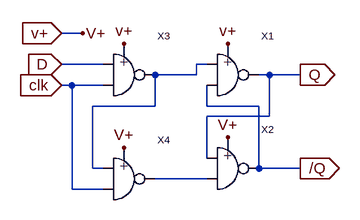
[diagram p0: schematic D-LATCH.asc]
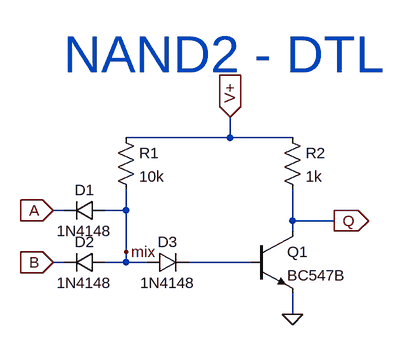
[diagram p1: sub-circuit nand2.asc]
D-LATCH.asc, the LTspice schematic file:
Version 4
SHEET 1 880 680
WIRE 128 176 96 176
WIRE 160 224 96 224
WIRE 320 224 304 224
WIRE 304 240 304 224
WIRE 304 240 240 240
WIRE 416 240 400 240
WIRE 464 240 416 240
WIRE 112 256 96 256
WIRE 160 256 112 256
WIRE 240 288 240 240
WIRE 240 288 144 288
WIRE 320 288 320 256
WIRE 400 288 320 288
WIRE 416 304 416 240
WIRE 416 304 320 304
WIRE 320 368 320 304
WIRE 144 384 144 288
WIRE 160 384 144 384
WIRE 400 384 400 288
WIRE 464 384 400 384
WIRE 320 400 240 400
WIRE 112 416 112 256
WIRE 160 416 112 416
FLAG 352 192 v+
FLAG 96 176 v+
IOPIN 96 176 In
FLAG 192 192 v+
FLAG 464 384 /Q
IOPIN 464 384 Out
FLAG 464 240 Q
IOPIN 464 240 Out
FLAG 96 224 D
IOPIN 96 224 In
FLAG 96 256 clk
IOPIN 96 256 In
FLAG 128 176 V+
FLAG 192 352 V+
FLAG 352 336 V+
SYMBOL NAND2 352 240 R0
SYMATTR InstName X1
SYMBOL NAND2 352 384 R0
SYMATTR InstName X2
SYMBOL NAND2 192 240 R0
SYMATTR InstName X3
SYMBOL NAND2 192 400 R0
SYMATTR InstName X4

nand2.asc, the sub-circuit schematic file:
Version 4
SHEET 1 880 680
WIRE 288 -48 288 -80
WIRE 288 -48 128 -48
WIRE 384 -48 288 -48
WIRE 32 64 16 64
WIRE 128 64 128 32
WIRE 128 64 96 64
WIRE 384 80 384 32
WIRE 448 80 384 80
WIRE 384 96 384 80
WIRE 128 128 128 64
WIRE 32 144 16 144
WIRE 128 144 128 128
WIRE 128 144 96 144
WIRE 160 144 128 144
WIRE 320 144 224 144
WIRE 384 224 384 192
FLAG 384 224 0
FLAG 448 80 Q
IOPIN 448 80 Out
FLAG 16 64 A
IOPIN 16 64 In
FLAG 16 144 B
IOPIN 16 144 In
FLAG 288 -80 V+
IOPIN 288 -80 In
FLAG 128 128 mix
SYMBOL diode 96 48 R90
WINDOW 0 0 32 VBottom 2
WINDOW 3 32 32 VTop 2
SYMATTR InstName D1
SYMATTR Value 1N4148
SYMBOL res 112 -64 R0
SYMATTR InstName R1
SYMATTR Value 10k
SYMBOL npn 320 96 R0
SYMATTR InstName Q1
SYMATTR Value BC547B
SYMBOL res 368 -64 R0
SYMATTR InstName R2
SYMATTR Value 1k
SYMBOL diode 96 128 R90
WINDOW 0 0 32 VBottom 2
WINDOW 3 32 32 VTop 2
SYMATTR InstName D2
SYMATTR Value 1N4148
SYMBOL diode 160 160 R270
WINDOW 0 32 32 VTop 2
WINDOW 3 0 32 VBottom 2
SYMATTR InstName D3
SYMATTR Value 1N4148
TEXT 32 -176 Left 6 ;NAND2 - DTL

The netlist it stands for:
* D-LATCH.asc
XX1 N001 /Q Q v+ nand2
XX2 Q N002 /Q v+ nand2
XX3 D clk N001 v+ nand2
XX4 N001 clk N002 v+ nand2

* block symbol definitions
.subckt nand2 A B Q V+
D1 mix A 1N4148
R1 V+ mix 10k
Q1 Q N001 0 0 BC547B
R2 V+ Q 1k
D2 mix B 1N4148
D3 mix N001 1N4148
* NAND2 - DTL
.ends nand2

.model D D
.lib standard.dio
.model NPN NPN
.model PNP PNP
.lib standard.bjt
.backanno
.end